# EasyEDA Pro project ProProject_nRF52840无线键盘_2024-02-15.epro, board PCB6
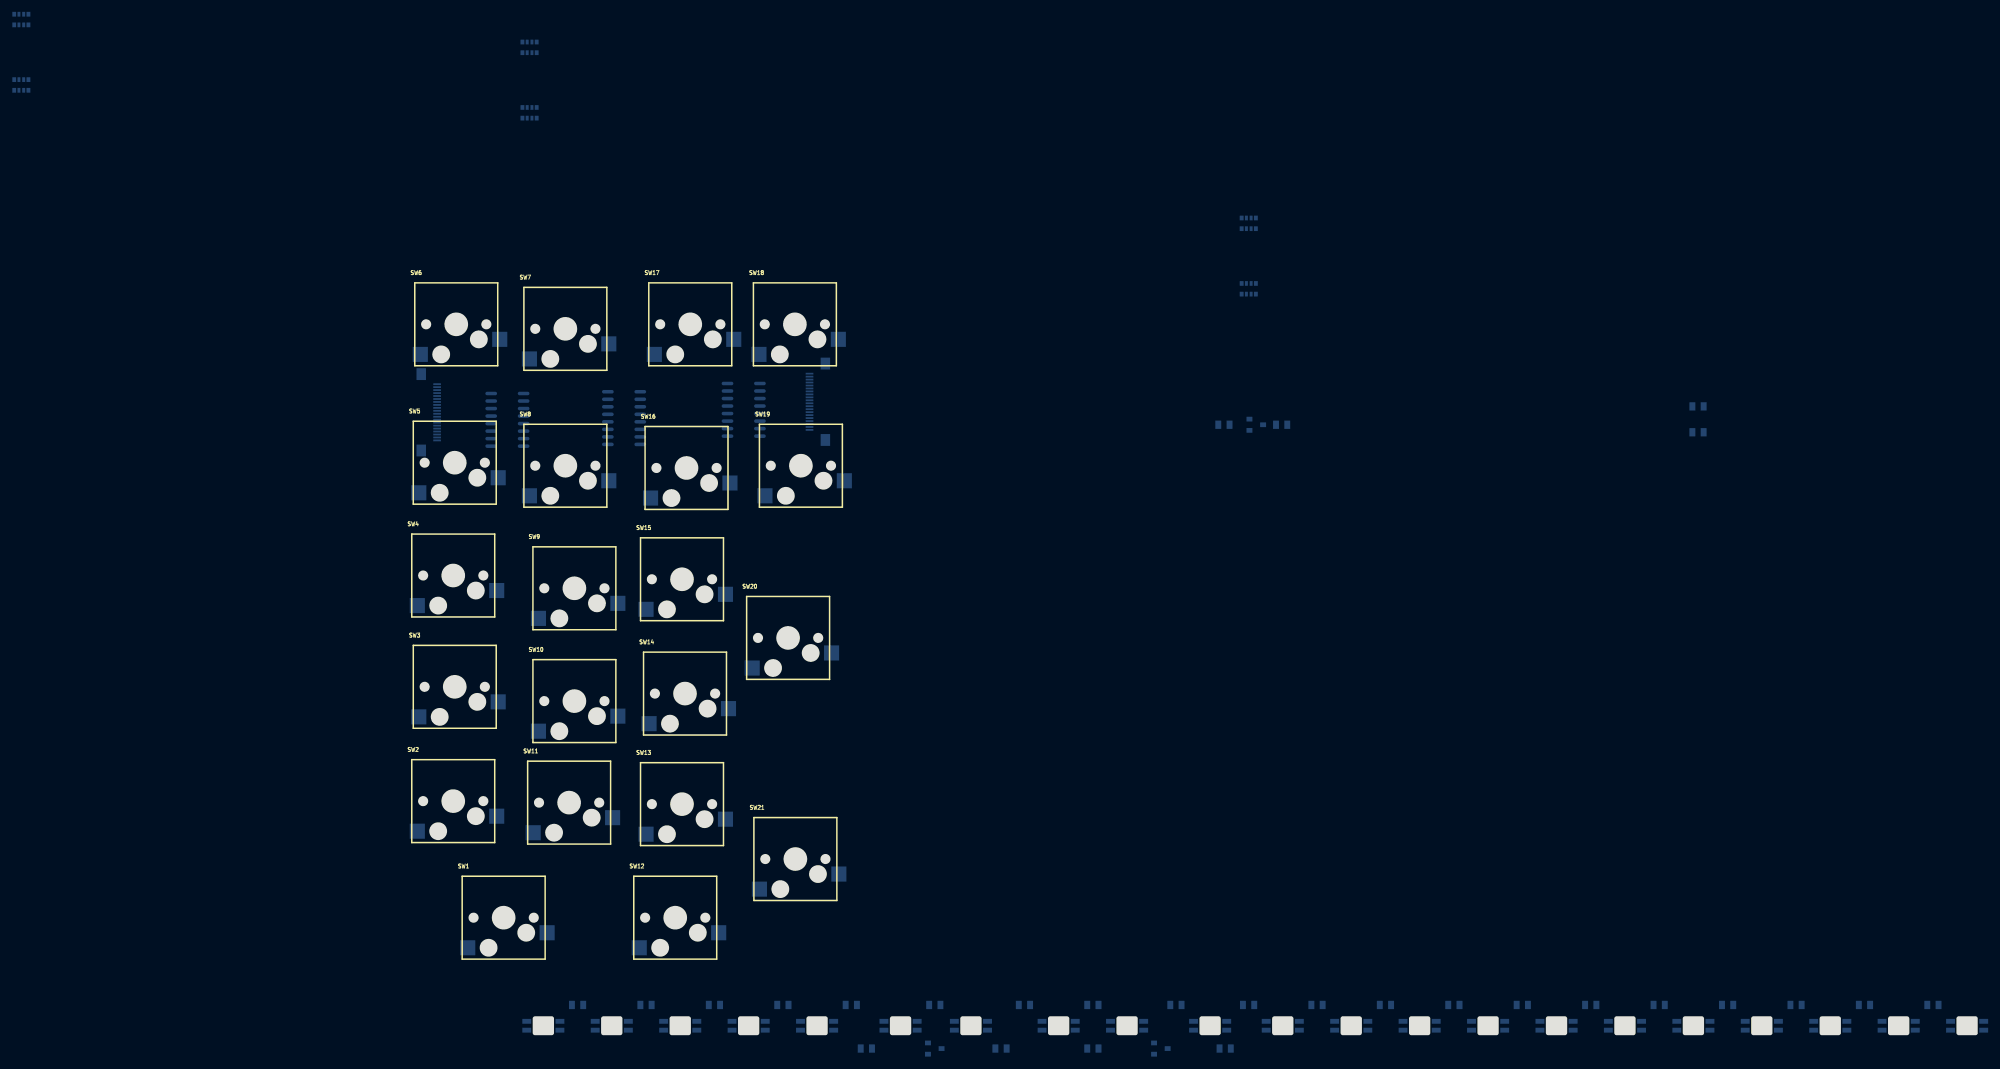
[diagram p12: board, top side]
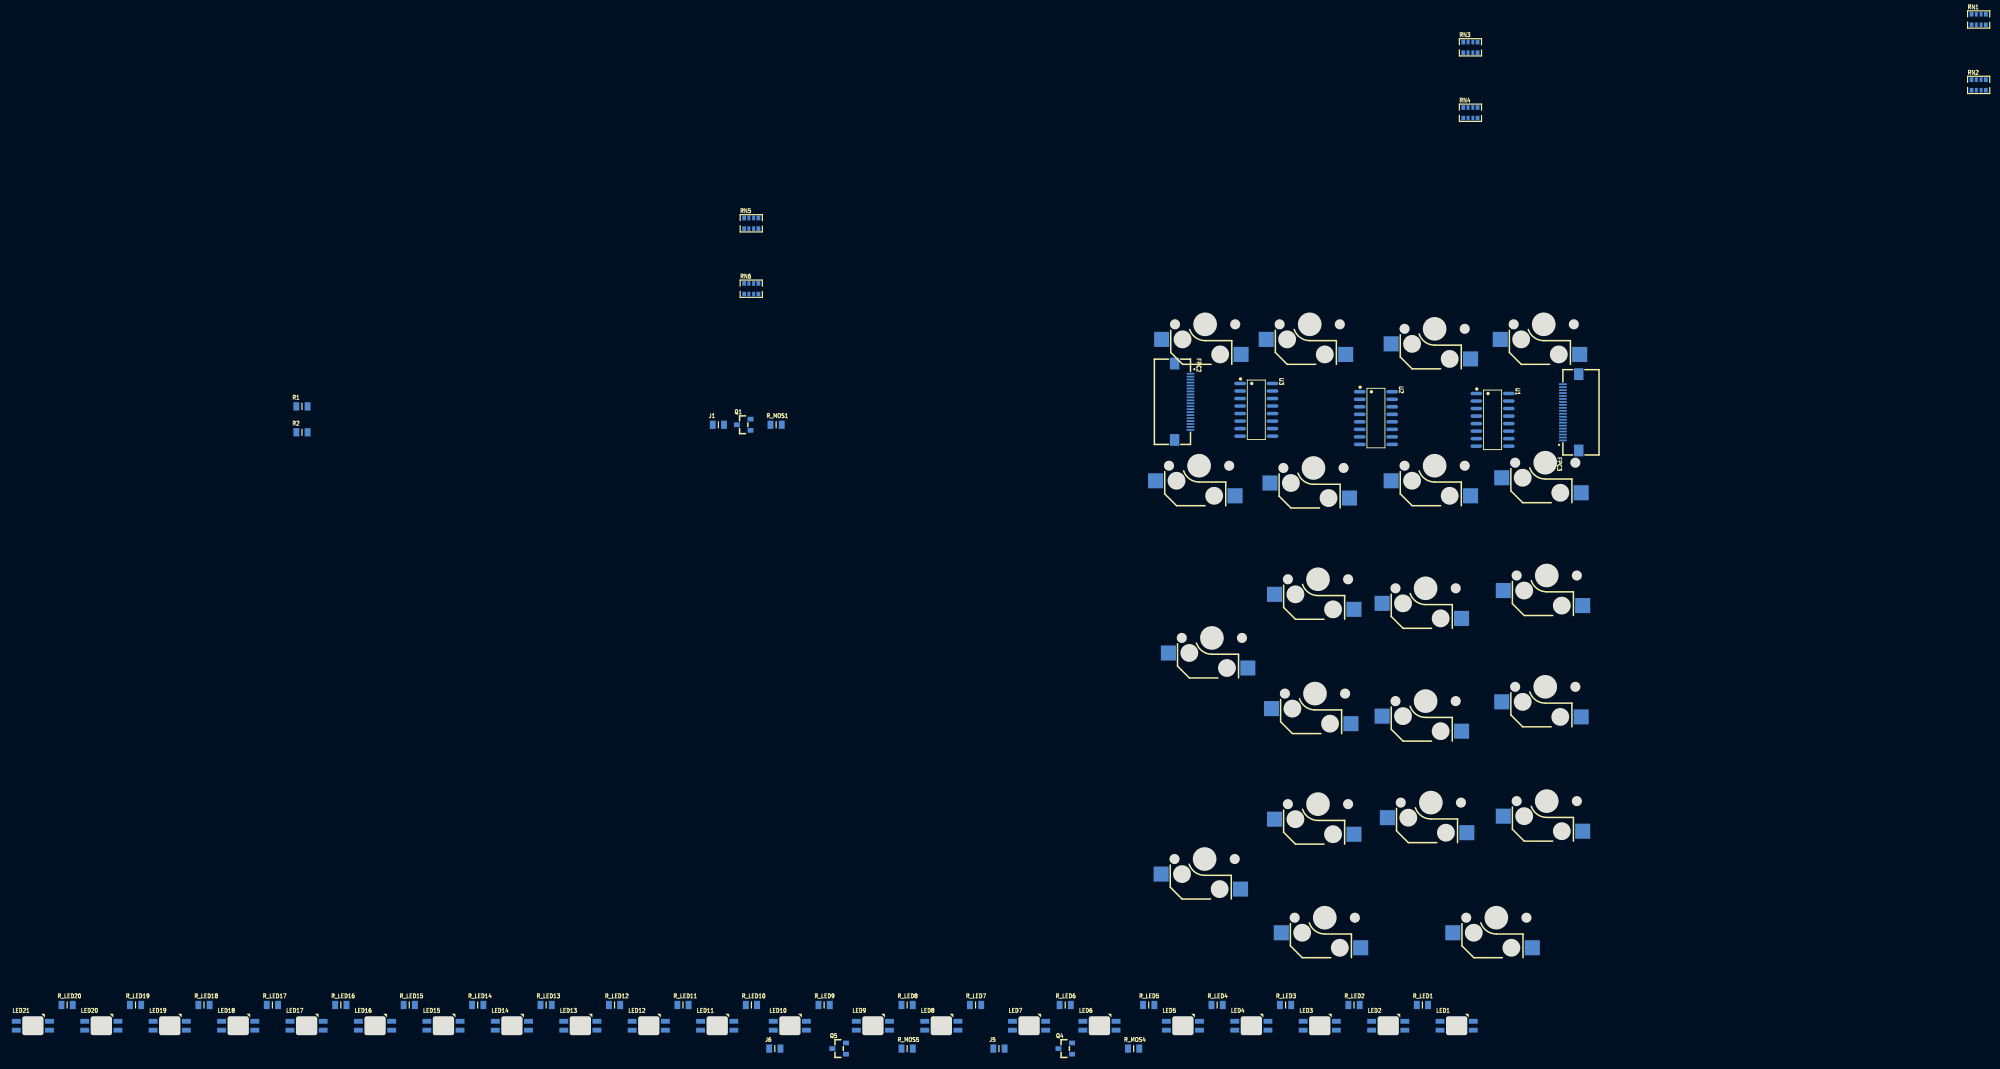
[diagram p13: board, bottom side, seen from below]

Outline 263.23 x 122.04 mm; copper layers: Top Layer, Bottom Layer. Coordinates in mm from the lower left corner of the outline.
Stack: Top Layer 0.035mm / Dielectric1 1.51mm FR4 er 4.5 / Bottom Layer 0.035mm

## Design rules (mm)
template: JLCPCB Capability(Two Layers Board)
spacing copperThickness1oz (default): track to track 0.102, other pairs 0.152 to 0.3
spacing copperThickness2oz: track to track 0.203, other pairs 0.152 to 0.3
track width copperThickness1oz (default): min 0.127, default 0.254, max 2.54
track width copperThickness2oz: min 0.203, default 0.254, max 2.54
differential pair differentialPair (default): width min 0.127, default 0.254, max 2.54; gap min 0.152, default 0.152
via viaSize (default): diameter min 0.5, default 0.61, max 10; hole min 0.3, default 0.305, max 6.3

## Placement (name value [footprint] x y rotation side)
FPC2  AFC01-S20FCA-00  [FPC-SMD_P0.5-20P_FGS-XJ-H2.0]  67.4 106.97 270 bottom
FPC3  AFC01-S20FCA-00  [FPC-SMD_P0.5-20P_FGS-XJ-H2.0]  1.87 105.19 90 bottom
J1  0R  [0805]  145.74 103.09 180 bottom
J5  0R  [0805]  98.38 -2.25 180 bottom
J6  0R  [0805]  136.21 -2.25 180 bottom
LED1  -  [WS2812_3528LED]  21.14 1.6 180 bottom
LED2  -  [WS2812_3528LED]  32.69 1.6 180 bottom
LED3  -  [WS2812_3528LED]  44.24 1.6 180 bottom
LED4  -  [WS2812_3528LED]  55.79 1.6 180 bottom
LED5  -  [WS2812_3528LED]  67.34 1.6 180 bottom
LED6  -  [WS2812_3528LED]  81.42 1.6 180 bottom
LED7  -  [WS2812_3528LED]  93.3 1.6 180 bottom
LED8  -  [WS2812_3528LED]  108.11 1.6 180 bottom
LED9  -  [WS2812_3528LED]  119.66 1.6 180 bottom
LED10  -  [WS2812_3528LED]  133.67 1.6 180 bottom
LED11  -  [WS2812_3528LED]  145.93 1.6 180 bottom
LED12  -  [WS2812_3528LED]  157.48 1.6 180 bottom
LED13  -  [WS2812_3528LED]  169.03 1.6 180 bottom
LED14  -  [WS2812_3528LED]  180.58 1.6 180 bottom
LED15  -  [WS2812_3528LED]  192.13 1.6 180 bottom
LED16  -  [WS2812_3528LED]  203.68 1.6 180 bottom
LED17  -  [WS2812_3528LED]  215.23 1.6 180 bottom
LED18  -  [WS2812_3528LED]  226.78 1.6 180 bottom
LED19  -  [WS2812_3528LED]  238.33 1.6 180 bottom
LED20  -  [WS2812_3528LED]  249.88 1.6 180 bottom
LED21  -  [WS2812_3528LED]  261.43 1.6 180 bottom
Q1  AO3400  [SOT-23_L2.9-W1.3-P1.90-LS2.4-BR]  141.46 103.09 180 bottom
Q4  AO3400  [SOT-23_L2.9-W1.3-P1.90-LS2.4-BR]  87.2 -2.25 180 bottom
Q5  AO3400  [SOT-23_L2.9-W1.3-P1.90-LS2.4-BR]  125.36 -2.25 180 bottom
R1  0R  [0805]  216.01 106.19 180 bottom
R2  0R  [0805]  216.01 101.82 180 bottom
R_LED1  500R  [0805]  26.91 5.11 180 bottom
R_LED2  500R  [0805]  38.46 5.11 180 bottom
R_LED3  500R  [0805]  50.01 5.11 180 bottom
R_LED4  500R  [0805]  61.56 5.11 180 bottom
R_LED5  500R  [0805]  73.11 5.11 180 bottom
R_LED6  500R  [0805]  87.2 5.11 180 bottom
R_LED7  500R  [0805]  102.33 5.11 180 bottom
R_LED8  500R  [0805]  113.88 5.11 180 bottom
R_LED9  500R  [0805]  127.9 5.11 180 bottom
R_LED10  500R  [0805]  140.16 5.11 180 bottom
R_LED11  500R  [0805]  151.71 5.11 180 bottom
R_LED12  500R  [0805]  163.26 5.11 180 bottom
R_LED13  500R  [0805]  174.81 5.11 180 bottom
R_LED14  500R  [0805]  186.36 5.11 180 bottom
R_LED15  500R  [0805]  197.91 5.11 180 bottom
R_LED16  500R  [0805]  209.46 5.11 180 bottom
R_LED17  500R  [0805]  221 5.11 180 bottom
R_LED18  500R  [0805]  232.55 5.11 180 bottom
R_LED19  500R  [0805]  244.1 5.11 180 bottom
R_LED20  500R  [0805]  255.65 5.11 180 bottom
R_MOS1  100k  [0805]  135.99 103.09 180 bottom
R_MOS4  100k  [0805]  75.65 -2.25 180 bottom
R_MOS5  100k  [0805]  113.88 -2.25 180 bottom
RN1  10kΩ  [RES-ARRAY-SMD_0603-8P-L3.2-W1.6-BL]  -66.96 171.52 180 bottom
RN2  10kΩ  [RES-ARRAY-SMD_0603-8P-L3.2-W1.6-BL]  -66.96 160.47 180 bottom
RN3  10kΩ  [RES-ARRAY-SMD_0603-8P-L3.2-W1.6-BL]  18.81 166.82 180 bottom
RN4  10kΩ  [RES-ARRAY-SMD_0603-8P-L3.2-W1.6-BL]  18.81 155.77 180 bottom
RN5  10kΩ  [RES-ARRAY-SMD_0603-8P-L3.2-W1.6-BL]  140.19 137.1 180 bottom
RN6  10kΩ  [RES-ARRAY-SMD_0603-8P-L3.2-W1.6-BL]  140.19 126.05 180 bottom
SW1  MX Switch  [MX-Switch]  14.44 19.85 0 top
SW2  MX Switch  [MX-Switch]  5.93 39.53 0 top
SW3  MX Switch  [MX-Switch]  6.19 58.84 0 top
SW4  MX Switch  [MX-Switch]  5.93 77.63 0 top
SW5  MX Switch  [MX-Switch]  6.19 96.68 0 top
SW6  MX Switch  [MX-Switch]  6.44 120.05 0 top
SW7  MX Switch  [MX-Switch]  24.85 119.29 0 top
SW8  MX Switch  [MX-Switch]  24.85 96.17 0 top
SW9  MX Switch  [MX-Switch]  26.38 75.47 0 top
SW10  MX Switch  [MX-Switch]  26.38 56.42 0 top
SW11  MX Switch  [MX-Switch]  25.49 39.28 0 top
SW12  MX Switch  [MX-Switch]  43.4 19.85 0 top
SW13  MX Switch  [MX-Switch]  44.54 39.02 0 top
SW14  MX Switch  [MX-Switch]  45.05 57.69 0 top
SW15  MX Switch  [MX-Switch]  44.54 77 0 top
SW16  MX Switch  [MX-Switch]  45.3 95.79 0 top
SW17  MX Switch  [MX-Switch]  45.94 120.05 0 top
SW18  MX Switch  [MX-Switch]  63.59 120.05 0 top
SW19  MX Switch  [MX-Switch]  64.61 96.17 0 top
SW20  MX Switch  [MX-Switch]  62.45 67.09 0 top
SW21  MX Switch  [MX-Switch]  63.67 29.75 0 top
U1  74HC165D,653  [SOIC-16_L9.9-W3.9-P1.27-LS6.0-BL]  15.08 103.92 270 bottom
U2  74HC165D,653  [SOIC-16_L9.9-W3.9-P1.27-LS6.0-BL]  34.76 104.22 270 bottom
U3  74HC165D,653  [SOIC-16_L9.9-W3.9-P1.27-LS6.0-BL]  54.95 105.61 270 bottom

## Footprints (pads in the part's own frame, mm; a bottom-side part is the same pattern mirrored in y, then rotated)
0805
  rect 1x1.4 smd: 1(-0.95,0) 2(0.95,0)
FPC-SMD_P0.5-20P_FGS-XJ-H2.0
  rect 0.3x1.3 smd: 1(-4.748,1.339) 2(-4.248,1.339) 3(-3.748,1.339) 4(-3.248,1.339) 5(-2.748,1.339) 6(-2.248,1.339) 7(-1.748,1.339) 8(-1.248,1.339) 9(-0.748,1.339) 10(-0.248,1.339) 11(0.252,1.339) 12(0.752,1.339) 13(1.252,1.339) 14(1.752,1.339) 15(2.252,1.339) 16(2.752,1.339) 17(3.252,1.339) 18(3.752,1.339) 19(4.252,1.339) 20(4.752,1.339)
  rect 2x1.6 smd: 21(6.45,-1.339) 22(-6.45,-1.339)
MX-Switch
  rect 2.55x2.55 smd far side: 1(-6.066,-5.08) 2(7.335,-2.54)
RES-ARRAY-SMD_0603-8P-L3.2-W1.6-BL
  rect 0.65x0.8 smd: 1(-1.2,-0.9) 4(1.2,-0.9) 5(1.2,0.9) 8(-1.2,0.9)
  rect 0.5x0.8 smd: 2(-0.4,-0.9) 3(0.4,-0.9) 6(0.4,0.9) 7(-0.4,0.9)
SOIC-16_L9.9-W3.9-P1.27-LS6.0-BL
  oval 0.602x1.971 smd: 1(-4.445,-2.736) 2(-3.175,-2.736) 3(-1.905,-2.736) 4(-0.635,-2.736) 5(0.635,-2.736) 6(1.905,-2.736) 7(3.175,-2.736) 8(4.445,-2.736) 9(4.445,2.736) 10(3.175,2.736) 11(1.905,2.736) 12(0.635,2.736) 13(-0.635,2.736) 14(-1.905,2.736) 15(-3.175,2.736) 16(-4.445,2.736)
SOT-23_L2.9-W1.3-P1.90-LS2.4-BR
  rect 1x0.8 smd: 1(1.15,-0.95) 2(1.15,0.95) 3(-1.15,0)
WS2812_3528LED
  rect 1.501x0.821 smd: 1(2.799,0.75) 2(2.799,-0.75) 3(-2.799,-0.75) 4(-2.799,0.75)

## Nets
As in the schematic, except:
VCC3V3: FPC2.3 FPC2.4 FPC3.17 FPC3.18 J1.2 Q1.3 RN1.1 RN1.2 RN1.3 RN1.4 RN2.1 RN2.2 RN2.3 RN2.4 RN3.1 RN3.2 RN3.3 RN3.4 RN4.1 RN4.2 RN4.3 RN4.4 RN5.1 RN5.2 RN5.3 RN5.4 RN6.1 RN6.2 RN6.3 RN6.4

Pads without a net: FPC2 14 15 16 17 18; FPC3 3 4 5 6 7; LED21 2; U2 7; U3 7 10
